# EasyEDA schematic RaspberryPi TMC 3DPrinter HAT_2020-10-18_12-09-53.json
TITLE: RaspberryPi TMC 3DPrinter HAT; REV: 1.0; Date: 2020-10-10; Sheet: 1/1
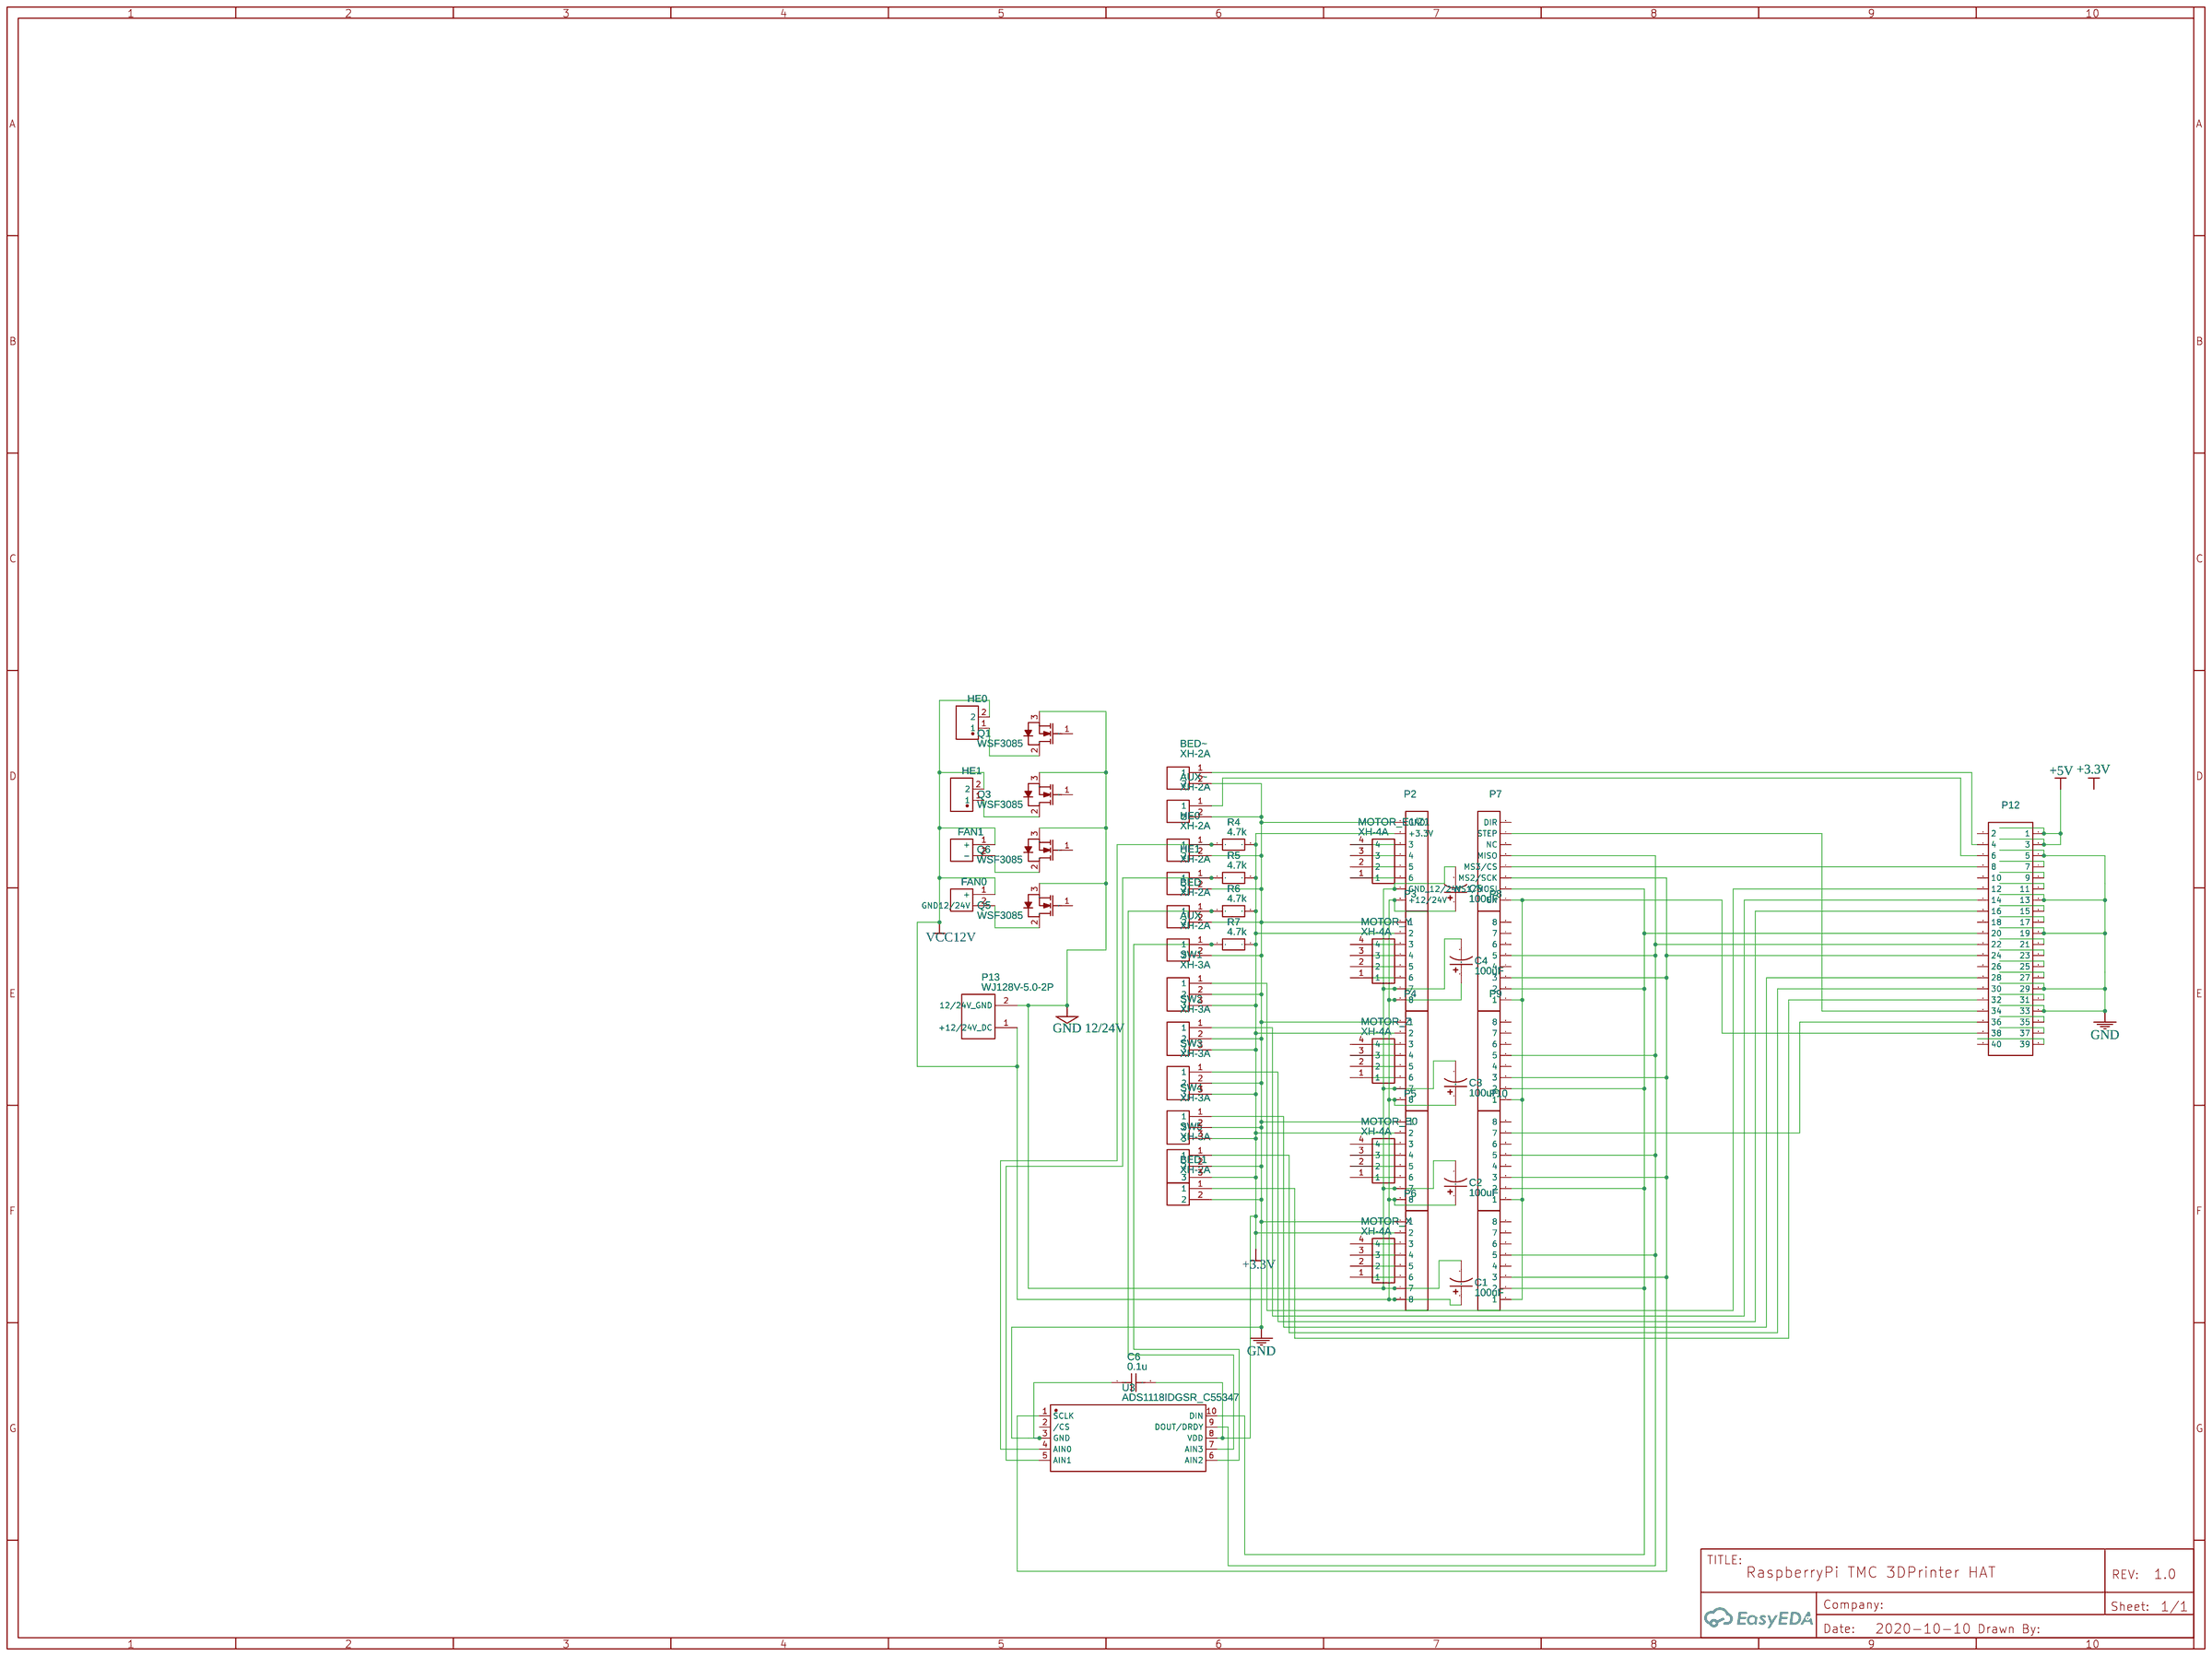
[diagram p0: schematic sheet]

## Parts
AUX  XH-2A  [CONN-TH_XH-2A]
AUX&#126;  XH-2A  [CONN-TH_XH-2A]
AUX~  XH-2A
BED  XH-2A  [CONN-TH_XH-2A]
BED1  XH-2A  [CONN-TH_XH-2A]
BED&#126;  XH-2A  [CONN-TH_XH-2A]
BED~  XH-2A
C1  100uF  [CAP-SMD_BD6.3-L6.6-W6.6-FD]
C2  100uF  [CAP-SMD_BD6.3-L6.6-W6.6-FD]
C3  100uF  [CAP-SMD_BD6.3-L6.6-W6.6-FD]
C4  100uF  [CAP-SMD_BD6.3-L6.6-W6.6-FD]
C5  100uF  [CAP-SMD_BD6.3-L6.6-W6.6-FD]
C6  0.1u  [C0603]
FAN0  FAN0  [CONN-TH_XH-2A]
FAN1  FAN1  [CONN-TH_XH-2A]
HE0  XH-2A  [CONN-TH_XH-2A]
HE1  XH-2A  [CONN-TH_XH-2A]
MOTOR_E0  XH-4A  [CONN-TH_4P-P2.50_XH-4A]
MOTOR_E1/Z1  XH-4A  [CONN-TH_4P-P2.50_XH-4A]
MOTOR_X  XH-4A  [CONN-TH_4P-P2.50_XH-4A]
MOTOR_Y  XH-4A  [CONN-TH_4P-P2.50_XH-4A]
MOTOR_Z  XH-4A  [CONN-TH_4P-P2.50_XH-4A]
P2  Header-Female-2.54_1x8  [HDR-TH_8P-P2.54-V]
P3  Header-Female-2.54_1x8  [HDR-TH_8P-P2.54-V]
P4  Header-Female-2.54_1x8  [HDR-TH_8P-P2.54-V]
P5  Header-Female-2.54_1x8  [HDR-TH_8P-P2.54-V]
P6  Header-Female-2.54_1x8  [HDR-TH_8P-P2.54-V]
P7  Header-Female-2.54_1x8  [HDR-TH_8P-P2.54-V]
P8  Header-Female-2.54_1x8  [HDR-TH_8P-P2.54-V]
P9  Header-Female-2.54_1x8  [HDR-TH_8P-P2.54-V]
P10  Header-Female-2.54_1x8  [HDR-TH_8P-P2.54-V]
P11  Header-Female-2.54_1x8  [HDR-TH_8P-P2.54-V]
P12  Header-Female-2.54_2x20  [HDR-TH_40P-P2.54-V-R2-C20-S2.54]
P13  WJ128V-5.0-2P  [CONN-TH_2P-P5.00_WJ128V-5.0-2P]
Q1  WSF3085  [TO-252-2_L6.6-W6.1-P4.57-LS9.9-TL-CW]
Q3  WSF3085  [TO-252-2_L6.6-W6.1-P4.57-LS9.9-TL-CW]
Q5  WSF3085  [TO-252-2_L6.6-W6.1-P4.57-LS9.9-TL-CW]
Q6  WSF3085  [TO-252-2_L6.6-W6.1-P4.57-LS9.9-TL-CW]
R4  4.7k  [R0603]
R5  4.7k  [R0603]
R6  4.7k  [R0603]
R7  4.7k  [R0603]
SW1  XH-3A  [CONN-TH_XH-3A]
SW2  XH-3A  [CONN-TH_XH-3A]
SW3  XH-3A  [CONN-TH_XH-3A]
SW4  XH-3A  [CONN-TH_XH-3A]
SW5  XH-3A  [CONN-TH_XH-3A]
U3  ADS1118IDGSR_C55347  [VSSOP-10_L3.0-W3.0-P0.50-LS4.9-BL]
U5  HE0  [CONN-TH_2P-P3.81_L7.4-W7.6]
U7  HE1  [CONN-TH_2P-P3.81_L7.4-W7.6]

## Library data of the parts
AUX AUX&#126; BED BED1 BED&#126; FAN0 FAN1 HE0 HE1 = XH-2A: Supplier: LCSC; Manufacturer: BOOMELE; image: //image.lceda.cn/szlcsc/C20079.jpg; Supplier Part: C20079
AUX~ = XH-2A_1: BOM_Manufacturer: BOOMELE; BOM_Supplier Part: C20079; BOM_Supplier: LCSC
BED~ = XH-2A: BOM_Manufacturer: BOOMELE; BOM_Supplier Part: C20079; BOM_Supplier: LCSC
C1-C5 = UUR1V101MCL6GS: Supplier: LCSC; Supplier Part: C129289; Manufacturer: CEC; Manufacturer Part: CA45-B-6.3V-100uF-K; Contributor: LCSC
C6 = C_0603_US: Supplier Part: C28233; Supplier: LCSC; Contributor: LCEDA_Lib; Manufacturer Part: CL21B104KCFNNNE; Manufacturer: SAMSUNG
MOTOR_E0 MOTOR_E1/Z1 MOTOR_X MOTOR_Y MOTOR_Z = XH-4A: Supplier: LCSC; Manufacturer: BOOMELE; image: //image.lceda.cn/szlcsc/C37815.jpg; Supplier Part: C37815
P2-P11 = Header-Female-2.54_1x8: Supplier: LCSC; Manufacturer: BOOMELE; Manufacturer Part: Female headerHDR1X8-2.54; Supplier Part: C27438
P12 = Header-Female-2.54_2x20: Supplier: LCSC; Manufacturer: BOOMELE; Manufacturer Part: 2.54mm 2*20PFemale header; image: //image.lceda.cn/szlcsc/C50982.jpg; Supplier Part: C50982; Package Display: No
P13 = WJ128V-5.0-2P: Supplier: LCSC; Manufacturer: ReliaPro; Supplier Part: C8269
Q1 Q3 Q5 Q6 = WSF3085: Supplier: LCSC; Supplier Part: C148428; Manufacturer: Winsok Semicon; Contributor: LCSC; LCSC Assembly: Yes; SMT Type: Extend
R4-R7 = R_0603_EU: Supplier Part: C414910; Supplier: LCSC; Contributor: LCEDA_Lib; Manufacturer Part: HP06W2J0472T5E; Manufacturer: UNI-ROYAL(Uniroyal Elec)
SW1-SW5 = XH-3A: Supplier: LCSC; Manufacturer: BOOMELE; image: //image.lceda.cn/szlcsc/C2316.jpg; Supplier Part: C2316
U3 = ADS1118IDGSR_C55347: Supplier: LCSC; Supplier Part: C55347; Manufacturer: Texas Instruments; Manufacturer Part: ADS1118IDGSR; Contributor: LCSC; LCSC Assembly: Yes; SMT Type: Extend
U5 U7 = DB125-3.81-2P: Supplier: LCSC; Supplier Part: C395878; Manufacturer: DIBO; Contributor: LCSC

## Nets
+3.3V: C6.2 P2.2(+3.3V) P3.2 P4.2 P5.2 P6.2 R4.2 R5.2 R6.2 R7.2 SW1.3 SW2.3 SW3.3 SW4.3 SW5.3 U3.8(VDD)
+5V: P12.1 P12.3
GND: AUX.2 AUX&#126;.2 BED.2 BED1.2 BED&#126;.2 C6.1 HE0.2 HE1.2 P2.1(GND) P3.1 P4.1 P5.1 P6.1 P12.5 P12.13 P12.19 P12.29 P12.33 SW1.2 SW2.2 SW3.2 SW4.2 SW5.2 U3.3(GND)
GND 12/24V: C1.2 C2.2 C3.2 C4.2 C5.2 P2.7(GND 12/24V) P3.7 P4.7 P5.7 P6.7 P13.2(12/24V GND) Q1.3(S) Q3.3(S) Q5.3(S) Q6.3(S)
VCC12V: C1.1 C2.1 C3.1 C4.1 C5.1 FAN0.1(+) FAN1.1(+) P2.8(+12/24V) P3.8 P4.8 P5.8 P6.8 P13.1(+12/24V DC) U5.2 U7.2
Net-(AUX&#126;-1): AUX&#126;.1 P12.6
Net-(AUX-1): AUX.1 R7.1 U3.6(AIN2)
Net-(BED1-1): BED1.1 P12.32
Net-(BED&#126;-1): BED&#126;.1 P12.4
Net-(BED-1): BED.1 R6.1 U3.7(AIN3)
Net-(FAN0-2): FAN0.2(GND12/24V) Q5.2(D)
Net-(FAN1-2): FAN1.2(-) Q6.2(D)
Net-(HE0-1): HE0.1 R4.1 U3.4(AIN0)
Net-(HE1-1): HE1.1 R5.1 U3.5(AIN1)
Net-(MOTOR_E0-1): MOTOR_E0.1 P5.6
Net-(MOTOR_E0-2): MOTOR_E0.2 P5.5
Net-(MOTOR_E0-3): MOTOR_E0.3 P5.4
Net-(MOTOR_E0-4): MOTOR_E0.4 P5.3
Net-(MOTOR_E1/Z1-1): MOTOR_E1/Z1.1 P2.6
Net-(MOTOR_E1/Z1-2): MOTOR_E1/Z1.2 P2.5
Net-(MOTOR_E1/Z1-3): MOTOR_E1/Z1.3 P2.4
Net-(MOTOR_E1/Z1-4): MOTOR_E1/Z1.4 P2.3
Net-(MOTOR_X-1): MOTOR_X.1 P6.6
Net-(MOTOR_X-2): MOTOR_X.2 P6.5
Net-(MOTOR_X-3): MOTOR_X.3 P6.4
Net-(MOTOR_X-4): MOTOR_X.4 P6.3
Net-(MOTOR_Y-1): MOTOR_Y.1 P3.6
Net-(MOTOR_Y-2): MOTOR_Y.2 P3.5
Net-(MOTOR_Y-3): MOTOR_Y.3 P3.4
Net-(MOTOR_Y-4): MOTOR_Y.4 P3.3
Net-(MOTOR_Z-1): MOTOR_Z.1 P4.6
Net-(MOTOR_Z-2): MOTOR_Z.2 P4.5
Net-(MOTOR_Z-3): MOTOR_Z.3 P4.4
Net-(MOTOR_Z-4): MOTOR_Z.4 P4.3
Net-(P7-1): P7.1(EN) P8.1 P9.1 P10.1 P11.1 P12.38
Net-(P7-2): P7.2(MS1/MOSI) P8.2 P9.2 P10.2 P11.2 P12.20 U3.10(DIN)
Net-(P7-3): P7.3(MS2/SCK) P8.3 P9.3 P10.3 P11.3 P12.24 U3.1(SCLK)
Net-(P7-4): P7.4(MS3/CS) P12.8
Net-(P7-5): P7.5(MISO) P8.5 P9.5 P10.5 P11.5 P12.22 U3.9(DOUT/DRDY)
Net-(P7-7): P7.7(STEP) P12.34
Net-(P10-7): P10.7 P12.36
Net-(P12-12): P12.12 SW1.1
Net-(P12-14): P12.14 SW2.1
Net-(P12-16): P12.16 SW3.1
Net-(P12-28): P12.28 SW4.1
Net-(P12-30): P12.30 SW5.1
Net-(Q1-2): Q1.2(D) U5.1
Net-(Q3-2): Q3.2(D) U7.1

Not connected (* = marked no-connect by the designer): P7 6(NC) 8(DIR); P8 4 6 7 8; P9 4 6 7 8; P10 4 6 8; P11 4 6 7 8; P12 2 7 9 10 11 15 17 18 21 23 25 26 27 31 35 37 39 40; Q1 1(G); Q3 1(G); Q5 1(G); Q6 1(G); U3 2(/CS)
